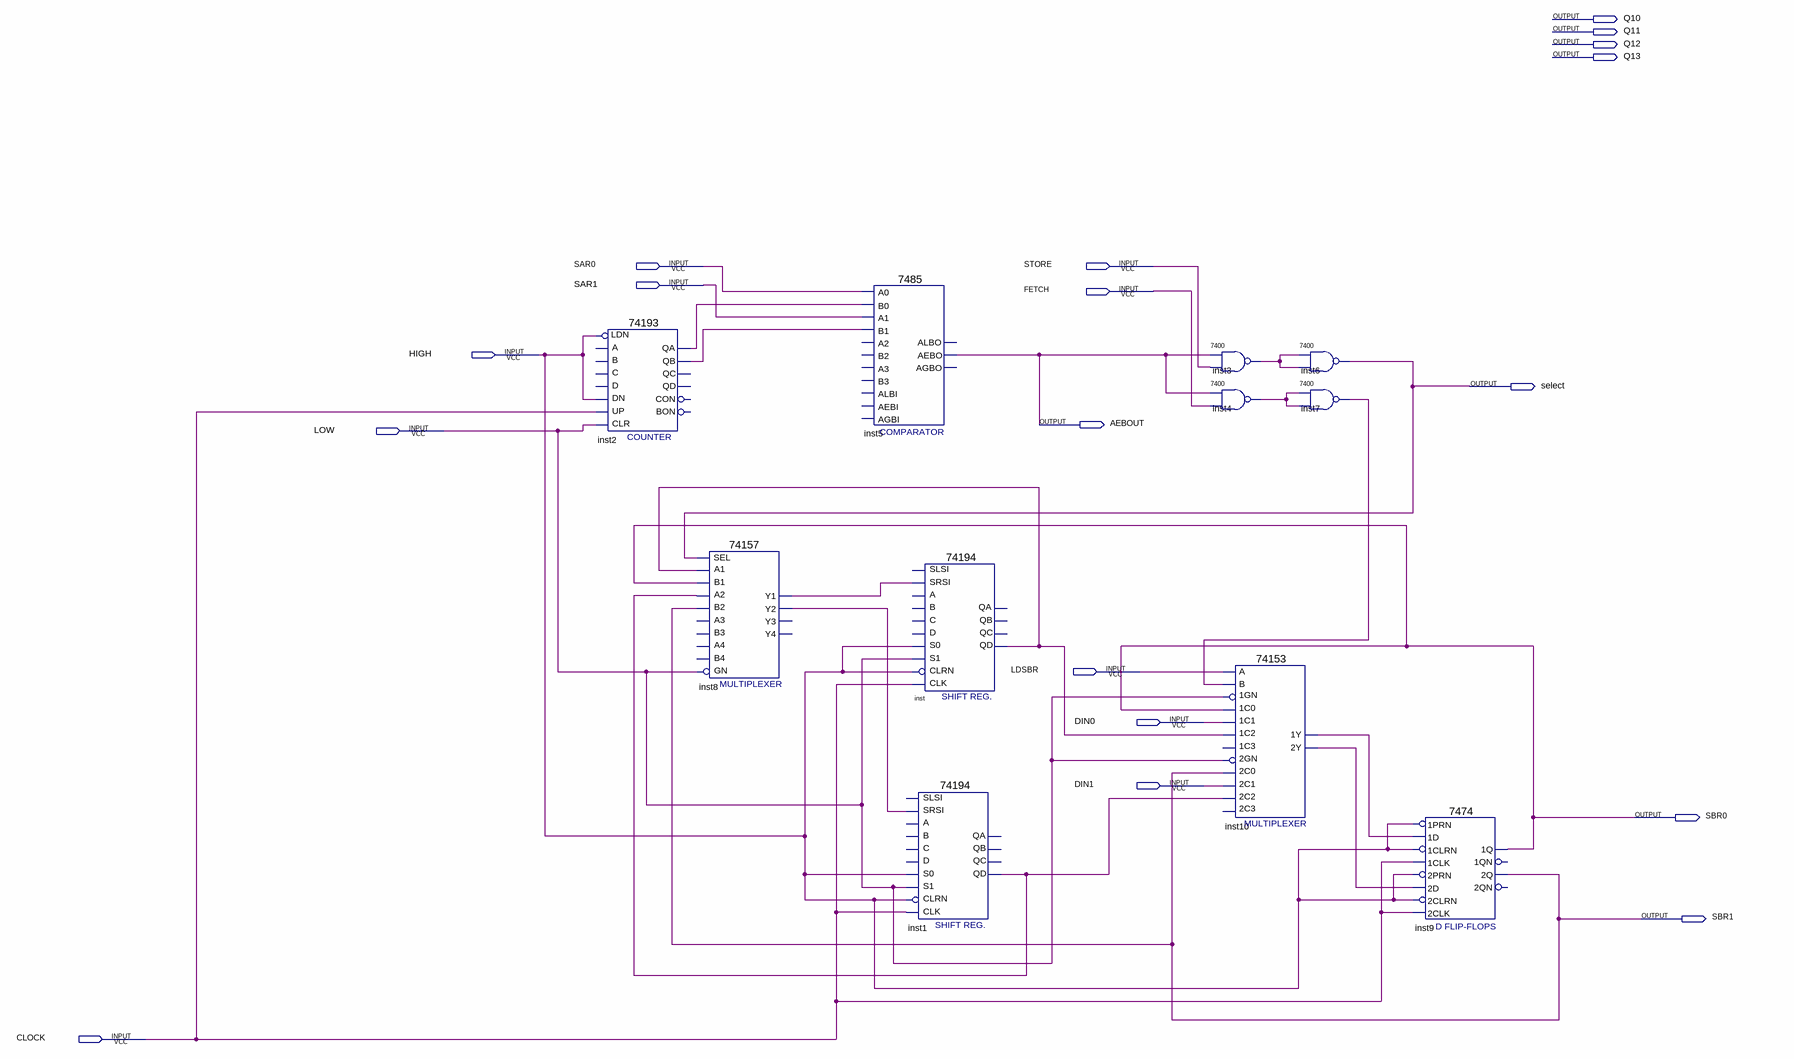
[diagram p0: schematic sheet]
// Quartus schematic lab2.bdf as structural Verilog: 11 symbols, 18 pins
module lab2 (
  input  SAR0,
  input  STORE,
  input  SAR1,
  input  FETCH,
  input  HIGH,
  input  LOW,
  input  LDSBR,
  input  DIN0,
  input  DIN1,
  input  CLOCK,
  output Q10,
  output Q11,
  output Q12,
  output Q13,
  output select,
  output AEBOUT,
  output SBR0,
  output SBR1
);

  wire inst1_qd, inst2_qa, inst2_qb, inst3_1, inst4_1, inst7_1, inst8_y1, inst8_y2, inst10_1y, inst10_2y,
       inst_qd;

  \74193  inst2 (
    .CLR(LOW), .UP(CLOCK), .DN(HIGH), .LDN(HIGH), .QB(inst2_qb), .QA(inst2_qa));  // open: D, C, B, A, CON, QD, QC, BON
  \74157  inst8 (
    .A1(inst_qd), .B1(SBR0), .SEL(select), .B2(SBR1), .A2(inst1_qd), .GN(LOW), .Y2(inst8_y2), .Y1(inst8_y1));  // open: A3, B3, B4, A4, Y4, Y3
  \7485  inst5 (
    .A0(SAR0), .B0(inst2_qa), .A1(SAR1), .B1(inst2_qb), .AEBO(AEBOUT));  // open: A3, B2, A2, AEBI, AGBI, ALBI, B3, ALBO, AGBO
  \74194  inst (
    .SRSI(inst8_y1), .CLK(CLOCK), .CLRN(HIGH), .S1(LOW), .S0(HIGH), .QD(inst_qd));  // open: SLSI, B, C, D, A, QA, QB, QC
  \74194  inst1 (
    .SRSI(inst8_y2), .CLK(CLOCK), .CLRN(HIGH), .S1(LOW), .S0(HIGH), .QD(inst1_qd));  // open: SLSI, B, C, D, A, QA, QB, QC
  \7400  inst3 (.\3 (STORE), .\2 (AEBOUT), .\1 (inst3_1));
  \7400  inst4 (.\3 (FETCH), .\2 (AEBOUT), .\1 (inst4_1));
  \74153  inst10 (
    .\1C1 (DIN0), .\1GN (LOW), .\1C0 (SBR0), .\2C0 (SBR1), .\2GN (LOW), .\2C2 (inst1_qd), .\1C2 (inst_qd),
    .B(inst7_1), .A(LDSBR), .\2C1 (DIN1), .\1Y (inst10_1y), .\2Y (inst10_2y));  // open: 1C3, 2C3
  \7400  inst6 (.\3 (inst3_1), .\2 (inst3_1), .\1 (select));
  \7400  inst7 (.\3 (inst4_1), .\2 (inst4_1), .\1 (inst7_1));
  \7474  inst9 (
    .\2D (inst10_2y), .\2PRN (HIGH), .\1CLK (CLOCK), .\1D (inst10_1y), .\1PRN (HIGH), .\2CLK (CLOCK),
    .\2CLRN (HIGH), .\1CLRN (HIGH), .\2Q (SBR1), .\1Q (SBR0));  // open: 1QN, 2QN
endmodule
